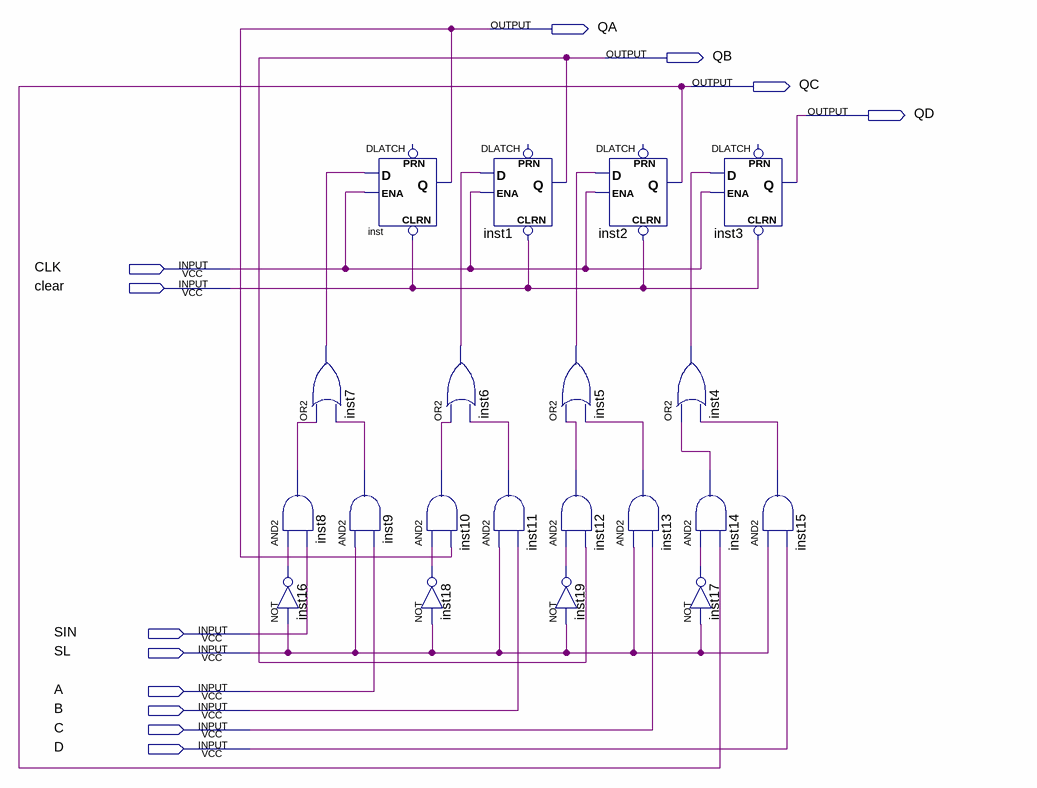
[diagram p0: schematic sheet]
// Quartus schematic ex8sr.bdf as structural Verilog: 20 symbols, 12 pins
module ex8sr (
  input  CLK,
  input  clear,
  input  SIN,
  input  SL,
  input  A,
  input  B,
  input  C,
  input  D,
  output QA,
  output QB,
  output QC,
  output QD
);

  wire inst4_out, inst5_out, inst6_out, inst7_out, inst8_out, inst9_out, inst10_out, inst11_out, inst12_out,
       inst13_out, inst14_out, inst15_out, inst16_out, inst17_out, inst18_out, inst19_out;

  or inst7 (inst7_out, inst8_out, inst9_out);
  and inst8 (inst8_out, inst16_out, SIN);
  not inst16 (inst16_out, SL);
  DLATCH inst (.CLRN(clear), .D(inst7_out), .ENA(CLK), .Q(QA));  // open: PRN
  and inst9 (inst9_out, SL, A);
  DLATCH inst1 (.CLRN(clear), .D(inst6_out), .ENA(CLK), .Q(QB));  // open: PRN
  or inst6 (inst6_out, inst10_out, inst11_out);
  and inst10 (inst10_out, inst18_out, QA);
  and inst11 (inst11_out, SL, B);
  not inst18 (inst18_out, SL);
  or inst5 (inst5_out, inst12_out, inst13_out);
  and inst12 (inst12_out, inst19_out, QB);
  not inst19 (inst19_out, SL);
  DLATCH inst2 (.CLRN(clear), .D(inst5_out), .ENA(CLK), .Q(QC));  // open: PRN
  and inst13 (inst13_out, SL, C);
  DLATCH inst3 (.CLRN(clear), .D(inst4_out), .ENA(CLK), .Q(QD));  // open: PRN
  or inst4 (inst4_out, inst14_out, inst15_out);
  and inst14 (inst14_out, inst17_out, QC);
  not inst17 (inst17_out, SL);
  and inst15 (inst15_out, SL, D);
endmodule
